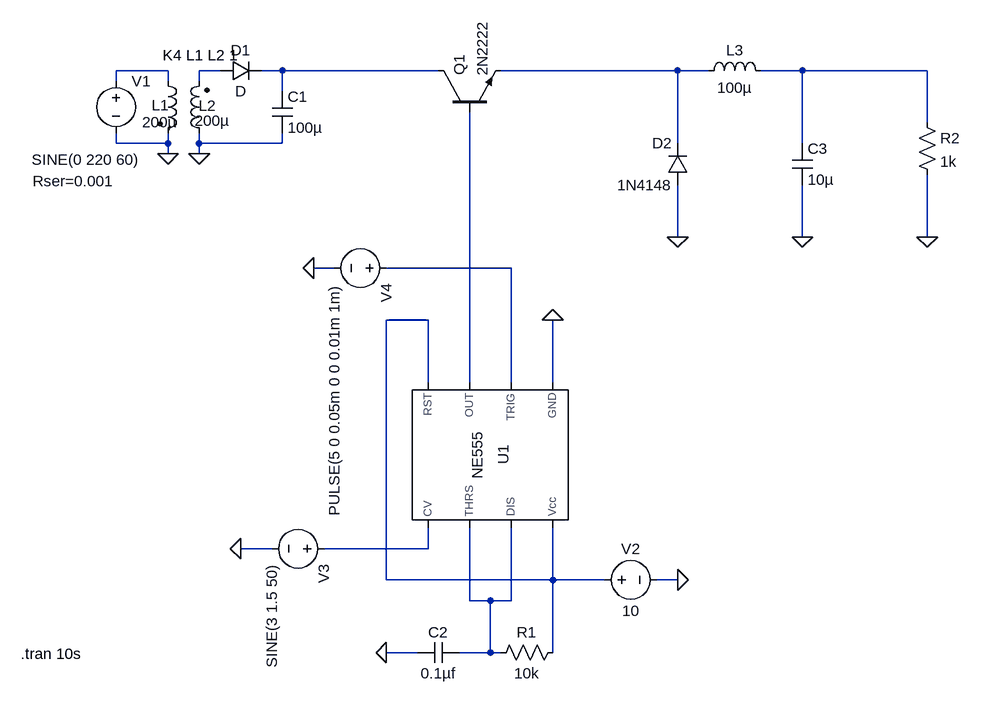
[diagram p0: schematic Buck Switching using PWM.asc]
Buck Switching using PWM.asc, the LTspice schematic file:
Version 4
SHEET 1 1368 944
WIRE 144 0 64 0
WIRE 224 0 192 0
WIRE 320 0 288 0
WIRE 560 0 320 0
WIRE 928 0 656 0
WIRE 976 0 928 0
WIRE 1120 0 1056 0
WIRE 1312 0 1120 0
WIRE 64 16 64 0
WIRE 144 16 144 0
WIRE 192 16 192 0
WIRE 320 32 320 0
WIRE 1312 80 1312 0
WIRE 64 112 64 96
WIRE 144 112 144 96
WIRE 144 112 64 112
WIRE 192 112 192 96
WIRE 320 112 320 96
WIRE 320 112 192 112
WIRE 928 112 928 0
WIRE 1120 112 1120 0
WIRE 144 128 144 112
WIRE 192 128 192 112
WIRE 928 256 928 176
WIRE 1120 256 1120 176
WIRE 1312 256 1312 160
WIRE 400 304 368 304
WIRE 672 304 480 304
WIRE 544 384 480 384
WIRE 544 480 544 384
WIRE 608 480 608 64
WIRE 672 480 672 304
WIRE 736 480 736 384
WIRE 304 736 256 736
WIRE 544 736 544 704
WIRE 544 736 384 736
WIRE 480 784 480 384
WIRE 736 784 736 704
WIRE 736 784 480 784
WIRE 816 784 736 784
WIRE 928 784 896 784
WIRE 608 816 608 704
WIRE 640 816 608 816
WIRE 672 816 672 704
WIRE 672 816 640 816
WIRE 528 896 480 896
WIRE 640 896 640 816
WIRE 640 896 592 896
WIRE 656 896 640 896
WIRE 736 896 736 784
FLAG 144 128 0
FLAG 192 128 0
FLAG 736 384 0
FLAG 928 784 0
FLAG 256 736 0
FLAG 480 896 0
FLAG 368 304 0
FLAG 928 256 0
FLAG 1120 256 0
FLAG 1312 256 0
SYMBOL voltage 64 0 R0
WINDOW 3 -130 137 Left 2
WINDOW 123 0 0 Left 0
WINDOW 39 -128 170 Left 2
SYMATTR Value SINE(0 220 60)
SYMATTR SpiceLine Rser=0.001
SYMATTR InstName V1
SYMBOL ind2 128 0 R0
WINDOW 0 -9 53 Left 2
WINDOW 3 -24 79 Left 2
SYMATTR InstName L1
SYMATTR Value 200µ
SYMBOL ind2 208 112 R180
WINDOW 0 -10 58 Left 2
WINDOW 3 -31 35 Left 2
SYMATTR InstName L2
SYMATTR Value 200µ
SYMBOL diode 224 16 R270
WINDOW 0 32 32 VTop 2
WINDOW 3 0 32 VBottom 2
SYMATTR InstName D1
SYMBOL cap 304 32 R0
SYMATTR InstName C1
SYMATTR Value 100µ
SYMBOL npn 560 64 R270
SYMATTR InstName Q1
SYMATTR Value 2N2222
SYMBOL Misc\\NE555 640 592 R90
SYMATTR InstName U1
SYMBOL voltage 800 784 R270
WINDOW 0 32 56 VTop 2
WINDOW 3 -32 56 VBottom 2
SYMATTR InstName V2
SYMATTR Value 10
SYMBOL voltage 400 736 R90
WINDOW 123 0 0 Left 0
WINDOW 39 0 0 Left 0
SYMATTR InstName V3
SYMATTR Value SINE(3 1.5 50)
SYMBOL cap 592 880 R90
WINDOW 0 0 32 VBottom 2
WINDOW 3 32 32 VTop 2
SYMATTR InstName C2
SYMATTR Value 0.1µf
SYMBOL res 752 880 R90
WINDOW 0 0 56 VBottom 2
WINDOW 3 32 56 VTop 2
SYMATTR InstName R1
SYMATTR Value 10k
SYMBOL voltage 496 304 R90
WINDOW 123 0 0 Left 0
WINDOW 39 0 0 Left 0
SYMATTR InstName V4
SYMATTR Value PULSE(5 0 0.05m 0 0 0.01m 1m)
SYMBOL diode 944 176 R180
WINDOW 0 24 64 Left 2
WINDOW 3 24 0 Left 2
SYMATTR InstName D2
SYMATTR Value 1N4148
SYMBOL cap 1104 112 R0
SYMATTR InstName C3
SYMATTR Value 10µ
SYMBOL ind 960 16 R270
WINDOW 0 32 56 VTop 2
WINDOW 3 5 56 VBottom 2
SYMATTR InstName L3
SYMATTR Value 100µ
SYMBOL res 1296 64 R0
SYMATTR InstName R2
SYMATTR Value 1k
TEXT 136 -24 Left 2 !K4 L1 L2 1
TEXT 12 898 Right 2 !.tran 10s

The netlist it stands for:
* Buck Switching using PWM.asc
V1 N001 0 SINE(0 220 60) Rser=0.001
L1 N001 0 200µ
L2 0 N002 200µ
D1 N002 N003 D
C1 N003 0 100µ
Q1 N003 N008 N004 0 2N2222
XU1 0 N006 N008 N007 N009 N010 N010 N007 NE555  ; pins GND TRIG OUT RST CV THRS DIS Vcc
V2 N007 0 10
V3 N009 0 SINE(3 1.5 50)
C2 N010 0 0.1µf
R1 N007 N010 10k
V4 N006 0 PULSE(5 0 0.05m 0 0 0.01m 1m)
D2 0 N004 1N4148
C3 N005 0 10µ
L3 N004 N005 100µ
R2 N005 0 1k
.model D D
.lib standard.dio
.model NPN NPN
.model PNP PNP
.lib standard.bjt
K4 L1 L2 1
.tran 10s
.lib NE555.sub
.backanno
.end